# Altium schematic sheet switch_tx.SchDoc
size A4; PageSetup: Record=PageOptions|CenterHorizontal=True|CenterVertical=True|PrintScale=1.39|XCorrection=1.00|YCorrection=1.00|PrintKind=1|BorderSize=5000000|LeftOffset=0|BottomOffset=0|Orientation=2|PaperLength=1000|PaperWidth=1000|Scale=100|PaperSource=15|PrintQuality=600|MediaType=1|DitherType=10|PrintScaleMode=1|PaperKind=A3|PaperIndex=8; Total Page: 1/1
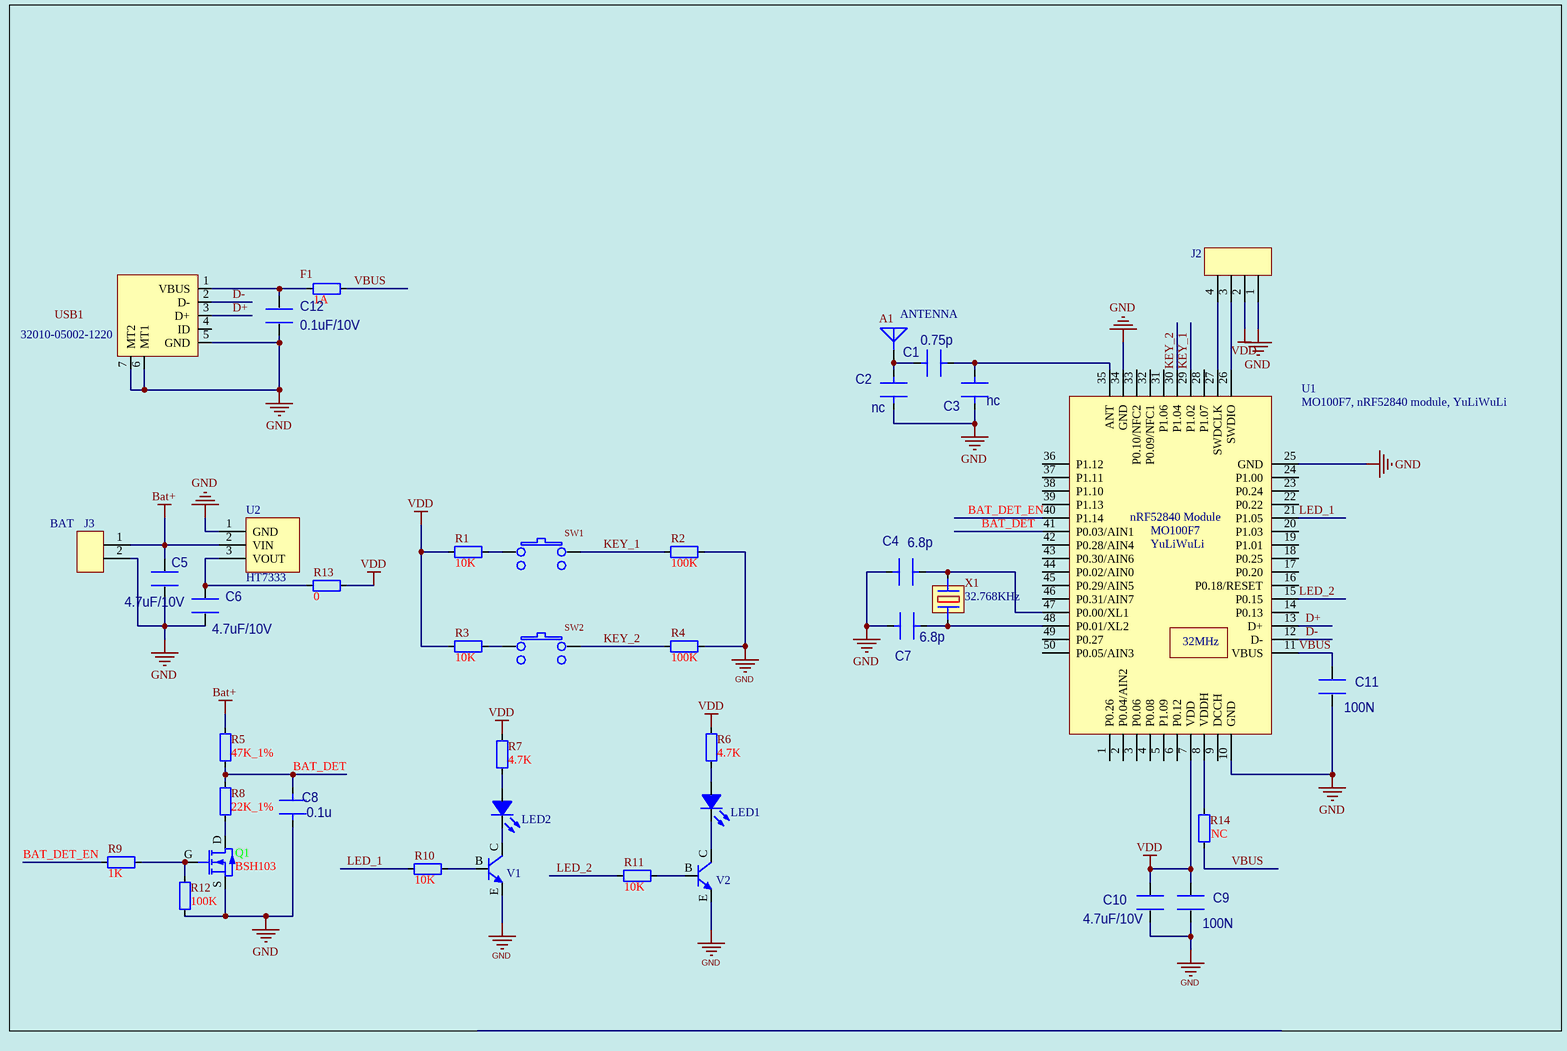
[diagram p0: switch_tx.SchDoc]

## Parts
A1  ANTENNA  [AN2]
C1  value 0.75p  [cap0603(1608)]  (hidden comment: CAP)
C2  value nc  [cap0603(1608)]  (hidden comment: CAP)
C3  value nc  [cap0603(1608)]  (hidden comment: CAP)
C4  value 6.8p  [cap0603(1608)]  (hidden comment: CAP)
C5  value 4.7uF/10V  [cap0603(1608)]  (hidden comment: CC103)
C6  value 4.7uF/10V  [cap0603(1608)]  (hidden comment: CC103)
C7  value 6.8p  [cap0603(1608)]  (hidden comment: CAP)
C8  value 0.1u  [cap0603(1608)]  (hidden comment: CAP)
C9  value 100N  [cap0603(1608)]  (hidden comment: CC103)
C10  value 4.7uF/10V  [cap0603(1608)]  (hidden comment: CC103)
C11  value 100N  [cap0603(1608)]  (hidden comment: CC103)
C12  value 0.1uF/10V  [cap0603(1608)]  (hidden comment: CC103)
F1  1A  [RESC0603(1608)_N]
J2  HEAD-1x4  [HEAD-1x4-2.54]  (value not drawn)
J3  BAT  [HEAD-1x2-2.54]
LED1  LED  [led_3mm]  (value not drawn)
LED2  LED  [led_3mm]  (value not drawn)
Q1  BSH103  [SOT-23-mosfet]
R1  10K  [RESC0603(1608)_N]
R2  100K  [RESC0603(1608)_N]
R3  10K  [RESC0603(1608)_N]
R4  100K  [RESC0603(1608)_N]
R5  47K_1%  [RESC0603(1608)_N]
R6  4.7K  [RESC0603(1608)_N]
R7  4.7K  [RESC0603(1608)_N]
R8  22K_1%  [RESC0603(1608)_N]
R9  1K  [RESC0603(1608)_N]
R10  10K  [RESC0603(1608)_N]
R11  10K  [RESC0603(1608)_N]
R12  100K  [RESC0603(1608)_N]
R13  0  [RESC0603(1608)_N]
R14  NC  [RESC0603(1608)_N]
SW1  TACT  [SW_6X6X5mm]  (value not drawn)
SW2  TACT  [SW_6X6X5mm]  (value not drawn)
U1  MO100F7, nRF52840 module, YuLiWuLi  [MO100F7]
U2  HT7333  [HT7333-SOT-89]
USB1  32010-05002-1220  [Micro USB]
V1  NPN  [SOT-23-NPN]  (value not drawn)
V2  NPN  [SOT-23-NPN]  (value not drawn)
X1  32.768KHz  [32.768_A]

## Nets
Bat+: C5.1 J3.1 R5.1 U2.2(VIN)
GND: C2.1 C3.2 C4.1 C5.2 C6.2 C7.1 C8.1 C9.2 C10.2 C11.2 C12.2 J2.1 J3.2 Q1.S R2.1 R4.2 R12.1 U1.10(GND) U1.25(GND) U1.34(GND) U2.1(GND) USB1.5(GND) USB1.6(MT1) USB1.7(MT2) V1.E V2.E
VDD: C9.1 C10.1 J2.2 R1.2 R3.2 R6.2 R7.2 R13.1 U1.7(VDD)
BAT_DET: C8.2 R5.2 R8.2 U1.41(P0.03/AIN1)
BAT_DET_EN: R9.2 U1.40(P1.14)
D+: U1.13(D+) USB1.3(D+)
D-: U1.12(D-) USB1.2(D-)
KEY_1: R2.2 SW1.1 U1.29(P1.02)
KEY_2: R4.1 SW2.1 U1.30(P1.04)
LED_1: R10.1 U1.21(P1.05)
LED_2: R11.1 U1.15(P0.15)
VBUS: C11.1 F1.1 R14.1 U1.11(VBUS)
NetA1_1: A1.1(A) C1.1 C2.2
NetC1_2: C1.2 C3.1 U1.35(ANT)
NetC4_2: C4.2 U1.47(P0.00/XL1) X1.2(OUT)
NetC6_1: C6.1 R13.2 U2.3(VOUT)
NetC7_2: C7.2 U1.48(P0.01/XL2) X1.1(IN)
NetC12_1: C12.1 F1.2 USB1.1(VBUS)
NetJ2_3: J2.3 U1.26(SWDIO)
NetJ2_4: J2.4 U1.27(SWDCLK)
NetLED1_1: LED1.1(A) R6.1
NetLED1_2: LED1.2(K) V2.C
NetLED2_1: LED2.1(A) R7.1
NetLED2_2: LED2.2(K) V1.C
NetQ1_D: Q1.D R8.1
NetQ1_G: Q1.G R9.1 R12.2
NetR1_1: R1.1 SW1.2
NetR3_1: R3.1 SW2.2
NetR10_2: R10.2 V1.B
NetR11_2: R11.2 V2.B
NetR14_2: R14.2 U1.8(VDDH)

Not connected (* = marked no-connect by the designer): U1 1(P0.26) 2(P0.04/AIN2) 3(P0.06) 4(P0.08) 5(P1.09) 6(P0.12) 9(DCCH) 14(P0.13) 16(P0.18/RESET) 17(P0.20) 18(P0.25) 19(P1.01) 20(P1.03) 22(P0.22) 23(P0.24) 24(P1.00) 28(P1.07) 31(P1.06) 32(P0.09/NFC1) 33(P0.10/NFC2) 36(P1.12) 37(P1.11) 38(P1.10) 39(P1.13) 42(P0.28/AIN4) 43(P0.30/AIN6) 44(P0.02/AIN0) 45(P0.29/AIN5) 46(P0.31/AIN7) 49(P0.27) 50(P0.05/AIN3); USB1 4(ID)

## Notes on the sheet
- (near U1) 32MHz
- Revision History List
- Date
- Revision
- 001
- New Design
- Description
- Project
- Rev
- Approval Date
- Page
- Author
- Approved By
- Document Number
- Info class:
- Strictly confidential
- Title
- Page Title
- Prototype A
- (in symbol MO100F7) nRF52840 Module; YuLiWuLi

## Library data of the parts
A1 = ANTENNA: PCB Antenna
C1-C4 C7 C8 = CAP: PART DESC: DECOUP CAP RADIAL BODY:.270 X.130 CENTERS:.200; PCB DECAL: CAP0603; SPICE PAR2: (C)
C5 C6 C9-C12 = CC103: PART DESC: CERAMIC CAPACITOR; PCB DECAL: CAP0603
F1 R1-R4 R6-R14 = Res: Value: 47K_1%; Publisher: i3tex; PackageReference: 0603; Mounting: SMD
J3 = HEAD-1x2
Q1 = MOSFET-N: N channel MOSFET, 20V, 3.7A, 39mohm; Published: 8-Jun-2000; LatestRevisionDate: 17-Jul-2002; LatestRevisionNote: Re-released for DXP Platform.; PackageVersion: 1995/1996; Publisher: Altium Limited; PackageDescription: TO, Flat Index; 3 In-Line, Axial Leads; Body Dia. 4.6mm; Lead Dia. 0.5 mm (max); PackageReference: SOT-23-MOSFET
R5 = Res: Publisher: i3tex; Value: 47K_1%; PackageReference: 0603; Mounting: SMD
SW1 SW2 = SWITCH_TACT_SPST_2-2_PINS
U1 = MO100F7
USB1 = Component_1: Mirco_USB_5S_B
X1 = Crystal_2PIN